# Altium schematic sheet PWR CTRL.SchDoc
size 69 x 64 mm
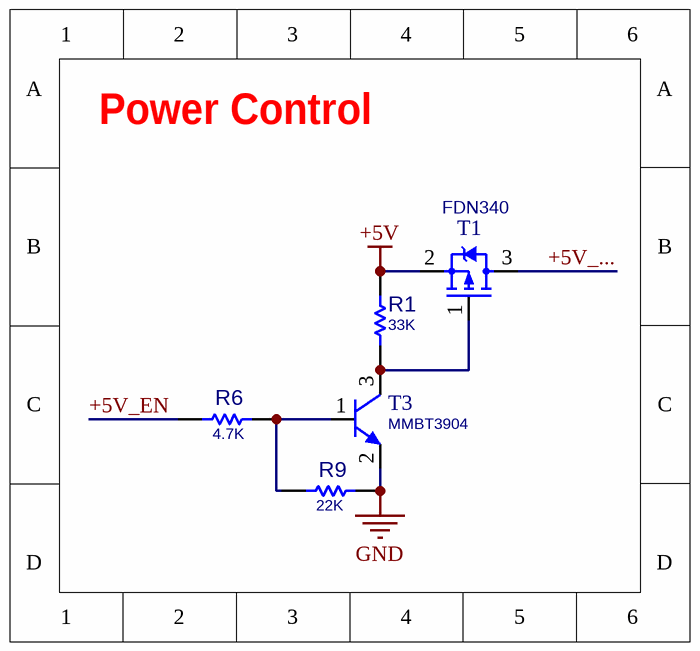
[diagram p0: PWR CTRL.SchDoc]

## Parts
R1  33K  [R0603]
R6  4.7K  [R0603]
R9  22K  [R0603]
T1  FDN340  [SOT23_3]
T3  MMBT3904  [SOT23_3]

## Nets
+5V: R1.2 T1.2(S)
GND: R9.1 T3.2(E)
+5V_...: T1.3(D)
+5V_EN: R6.2
NetR1_1: R1.1 T1.1(D) T3.3(C)
NetR6_1: R6.1 R9.2 T3.1(B)

## Notes on the sheet
- Power Control

## Library data of the parts
R1 R6 R9 = RES_SMD: RES, SMD; MANF_P#: RK73H1ETTP4701F; MANF: KOA SPEER; PARAM: 0.063W; DESC: DESCRIPTION; DIST#: MOUSER; PARAM2: 1%; ASSEMBLY: ASSEMBLY; PRICE: 100= 0.5$
  R1: VALUE: 33K
  R6: VALUE: 4.7K
  R9: VALUE: 22K
T1 = MOSP_FDN340_SOT23: MOSFET SMD P-CH 20V 2A; MANF_P#: FDN360; ASSEMBLY: ASSEMBLY; VALUE: FDN340
T3 = NPN_MMBT3904_SOT23: BJT, NPN, 40v, 0.2A, SMD, SOT23; PARAM2: 250mW; MANF: Diodes, NXP, FAIRCHILD, ON; PARAM: 40v, 0.2A; MANF_P#: MMBT3904; VALUE: MMBT3904